# EAGLE board zx81 SD_12 (smd) build002 (EAGLE 9.6.2), part 1 of 2
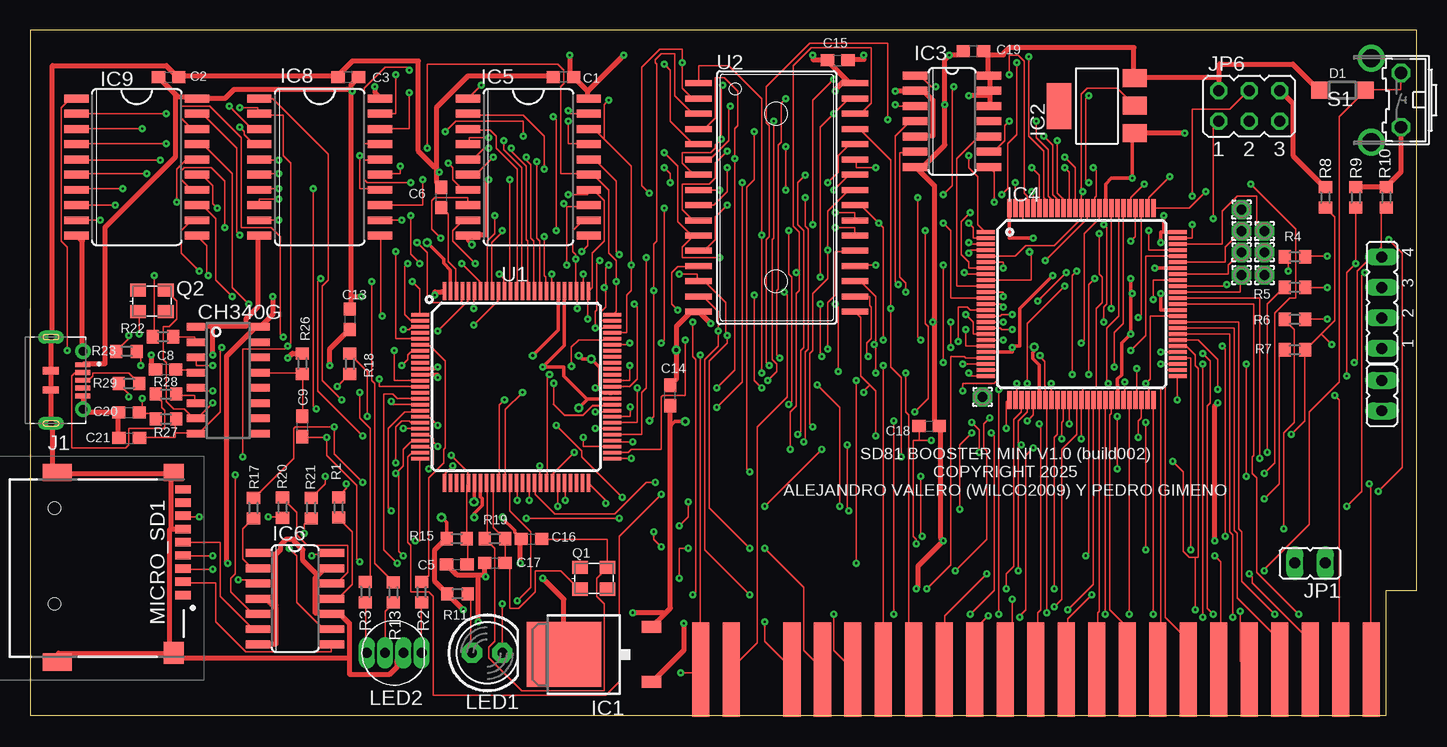
[diagram p3: board, top side]
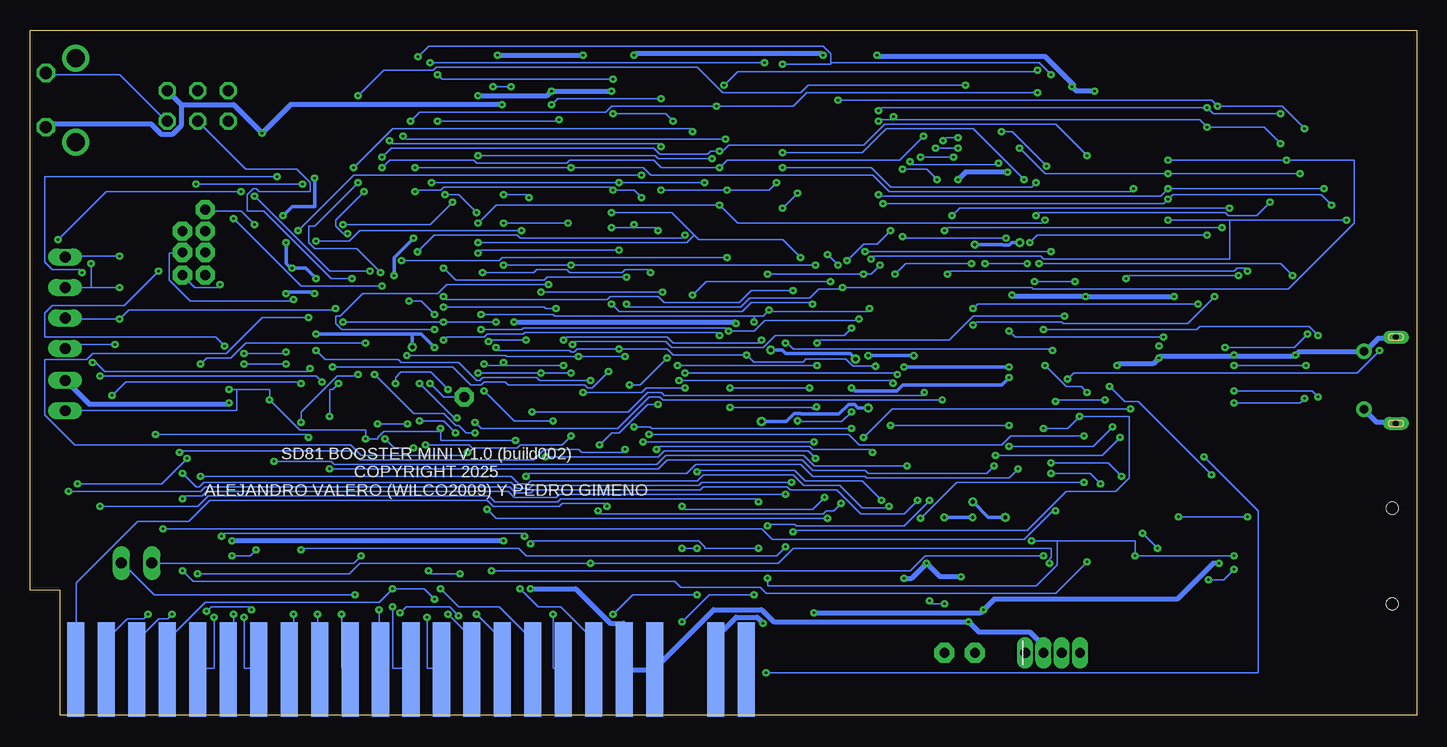
[diagram p4: board, bottom side, seen from below]

Size 115.57 x 57.15 mm. Coordinates in mm from the lower left corner, seen from the top.
Outline: 0,0 113.03,0 113.03,10.41 115.57,10.41 115.57,57.15 0,57.15 0,0
Copper layers (1*16): Top 0.035mm / dielectric 1.5mm / Bottom 0.035mm
Design rules "default *": minimum track width 5mil, minimum drill 0.2mm, track to track 6mil, track to pad 6mil, pad to pad 6mil, via to via 6mil, smd to smd 6mil, copper to edge 40mil, drill to drill 6mil, minimum pad ring 10mil, minimum via ring 8mil, stop-mask expansion 4mil, vias tented up to drill 999mil, thermal gap 10mil
Net classes: 1 VCC: width 0.3 mm; 2 3,3: width 0.3 mm

## Footprints (pad centres in the part's own frame; a part is rotated, then mirrored left to right if it is on the bottom)
EDGEPIN = smd 1.422 x 7.874: 1 0,0
C0603 = smd 1.1 x 1: 1 -0.85,0; 2 0.85,0
SOD123 = smd 1.4 x 1.4: A 1.9,0; C -1.9,0
TO252 = smd 1 x 1.6: 1 -2.28,-4.8; 2 2.28,-4.8 | smd 5.4 x 6.2: 3 0,2.5
SOT223 = smd 1.499 x 2.007: 1 -2.261,-3.15; 2 0.025,-3.15; 3 2.311,-3.15 | smd 3.81 x 2.007: 4 0,3.15
SO14 = smd 0.66 x 2.032: 1 -3.81,-3.073; 2 -2.54,-3.073; 3 -1.27,-3.073; 4 0,-3.073; 5 1.27,-3.073; 6 2.54,-3.073; 7 3.81,-3.073; 8 3.81,3.073; 9 2.54,3.073; 10 1.27,3.073; 11 0,3.073; 12 -1.27,3.073; 13 -2.54,3.073; 14 -3.81,3.073
TQFP100 = smd 1.5 x 0.345: 1 -8,6; 2 -8,5.5; 3 -8,5; 4 -8,4.5; 5 -8,4; 6 -8,3.5; 7 -8,3; 8 -8,2.5; 9 -8,2; 10 -8,1.5; 11 -8,1; 12 -8,0.5; 13 -8,0; 14 -8,-0.5; 15 -8,-1; 16 -8,-1.5; 17 -8,-2; 18 -8,-2.5; 19 -8,-3; 20 -8,-3.5; 21 -8,-4; 22 -8,-4.5; 23 -8,-5; 24 -8,-5.5; 25 -8,-6; 51 8,-6; 52 8,-5.5; 53 8,-5; 54 8,-4.5; 55 8,-4; 56 8,-3.5; 57 8,-3; 58 8,-2.5; 59 8,-2; 60 8,-1.5; 61 8,-1; 62 8,-0.5; 63 8,0; 64 8,0.5; 65 8,1; 66 8,1.5; 67 8,2; 68 8,2.5; 69 8,3; 70 8,3.5; 71 8,4; 72 8,4.5; 73 8,5; 74 8,5.5; 75 8,6 | smd 0.345 x 1.5: 26 -6,-8; 27 -5.5,-8; 28 -5,-8; 29 -4.5,-8; 30 -4,-8; 31 -3.5,-8; 32 -3,-8; 33 -2.5,-8; 34 -2,-8; 35 -1.5,-8; 36 -1,-8; 37 -0.5,-8; 38 0,-8; 39 0.5,-8; 40 1,-8; 41 1.5,-8; 42 2,-8; 43 2.5,-8; 44 3,-8; 45 3.5,-8; 46 4,-8; 47 4.5,-8; 48 5,-8; 49 5.5,-8; 50 6,-8; 76 6,8; 77 5.5,8; 78 5,8; 79 4.5,8; 80 4,8; 81 3.5,8; 82 3,8; 83 2.5,8; 84 2,8; 85 1.5,8; 86 1,8; 87 0.5,8; 88 0,8; 89 -0.5,8; 90 -1,8; 91 -1.5,8; 92 -2,8; 93 -2.5,8; 94 -3,8; 95 -3.5,8; 96 -4,8; 97 -4.5,8; 98 -5,8; 99 -5.5,8; 100 -6,8
SO20W = smd 0.66 x 2.032: 1 -5.715,-5.029; 2 -4.445,-5.029; 3 -3.175,-5.029; 4 -1.905,-5.029; 5 -0.635,-5.029; 6 0.635,-5.029; 7 1.905,-5.029; 8 3.175,-5.029; 9 4.445,-5.029; 10 5.715,-5.029; 11 5.715,5.029; 12 4.445,5.029; 13 3.175,5.029; 14 1.905,5.029; 15 0.635,5.029; 16 -0.635,5.029; 17 -1.905,5.029; 18 -3.175,5.029; 19 -4.445,5.029; 20 -5.715,5.029
SOIC16 = smd 0.635 x 1.524: 1 -4.445,-2.695; 2 -3.175,-2.695; 3 -1.905,-2.695; 4 -0.635,-2.695; 5 0.635,-2.695; 6 1.905,-2.695; 7 3.175,-2.695; 8 4.445,-2.695; 9 4.445,2.695; 10 3.175,2.695; 11 1.905,2.695; 12 0.635,2.695; 13 -0.635,2.695; 14 -1.905,2.695; 15 -3.175,2.695; 16 -4.445,2.695
SHOUHAN_MICROXNJ = smd 0.4 x 1.25: 1 1.3,-4.375; 2 0.65,-4.375; 3 0,-4.375; 4 -0.65,-4.375; 5 -1.3,-4.375 | smd 0.6 x 1.35: S1 -0.8,-1.725; S2 0.8,-1.725 | drill 0.5 pad 1.07 long: S3 -3.6,-1.75; S6 3.6,-1.75 | drill 0.7 pad 1.3: S4 -2.425,-4.4; S5 2.425,-4.4
JP1 = drill 0.914 long: 1 0,-1.27; 2 0,1.27
JP4 = drill 0.914 long: 1 -3.81,0; 2 -1.27,0; 3 1.27,0; 4 3.81,0
JP3Q = drill 0.914 octagon: 1 -2.54,-1.27; 2 -2.54,1.27; 3 0,-1.27; 4 0,1.27; 5 2.54,-1.27; 6 2.54,1.27
LED5MM = drill 0.813 pad 1.676 octagon: A -1.27,0; K 1.27,0
LED-RGB-THRU = drill 0.813 long: 1 2.286,0; 2 0.762,0; 3 -0.762,0; 4 -2.286,0
TF-01A = smd 0.7 x 1.3: 1 2.23,7.174; 2 1.13,7.174; 3 0.03,7.174; 4 -1.07,7.174; 5 -2.17,7.174; 6 -3.27,7.174; 7 -4.37,7.174; 8 -5.47,7.174; CD1 -6.57,7.174 | smd 1.448 x 1.651: MP1 -7.989,6.4 | smd 1.448 x 2.438: MP2 -7.989,-3.3; MP3 7.836,-3.3 | smd 1.854 x 1.651: MP4 7.061,6.4 | hole 1: -5.004,-3.531; 2.972,-3.531
1,6/0,8 = drill 0.813 pad 1.6 octagon: 1 0,0
3.2X2.5_KX-7 = smd 1.3 x 1.1: 1 -1.15,-0.9; 2 1.15,-0.9; 3 1.15,0.9; 4 -1.15,0.9
R0603 = smd 1 x 1.1: 1 -0.85,0; 2 0.85,0
B3F-31XX = drill 1.016 octagon: 1 -2.261,-1.245; 2 2.261,-1.245 | drill 1.499 pad 2.159: 3 -3.505,1.245; 4 3.505,1.245
TQFP100' = smd 1.5 x 0.3: 1 -8,6; 2 -8,5.5; 3 -8,5; 4 -8,4.5; 5 -8,4; 6 -8,3.5; 7 -8,3; 8 -8,2.5; 9 -8,2; 10 -8,1.5; 11 -8,1; 12 -8,0.5; 13 -8,0; 14 -8,-0.5; 15 -8,-1; 16 -8,-1.5; 17 -8,-2; 18 -8,-2.5; 19 -8,-3; 20 -8,-3.5; 21 -8,-4; 22 -8,-4.5; 23 -8,-5; 24 -8,-5.5; 25 -8,-6; 51 8,-6; 52 8,-5.5; 53 8,-5; 54 8,-4.5; 55 8,-4; 56 8,-3.5; 57 8,-3; 58 8,-2.5; 59 8,-2; 60 8,-1.5; 61 8,-1; 62 8,-0.5; 63 8,0; 64 8,0.5; 65 8,1; 66 8,1.5; 67 8,2; 68 8,2.5; 69 8,3; 70 8,3.5; 71 8,4; 72 8,4.5; 73 8,5; 74 8,5.5; 75 8,6 | smd 0.3 x 1.5: 26 -6,-8; 27 -5.5,-8; 28 -5,-8; 29 -4.5,-8; 30 -4,-8; 31 -3.5,-8; 32 -3,-8; 33 -2.5,-8; 34 -2,-8; 35 -1.5,-8; 36 -1,-8; 37 -0.5,-8; 38 0,-8; 39 0.5,-8; 40 1,-8; 41 1.5,-8; 42 2,-8; 43 2.5,-8; 44 3,-8; 45 3.5,-8; 46 4,-8; 47 4.5,-8; 48 5,-8; 49 5.5,-8; 50 6,-8; 76 6,8; 77 5.5,8; 78 5,8; 79 4.5,8; 80 4,8; 81 3.5,8; 82 3,8; 83 2.5,8; 84 2,8; 85 1.5,8; 86 1,8; 87 0.5,8; 88 0,8; 89 -0.5,8; 90 -1,8; 91 -1.5,8; 92 -2,8; 93 -2.5,8; 94 -3,8; 95 -3.5,8; 96 -4,8; 97 -4.5,8; 98 -5,8; 99 -5.5,8; 100 -6,8
SOP32-5 = smd 2.2 x 0.5: 1 -6.516,9.525; 2 -6.516,8.255; 3 -6.516,6.985; 4 -6.516,5.715; 5 -6.516,4.445; 6 -6.516,3.175; 7 -6.516,1.905; 8 -6.516,0.635; 9 -6.516,-0.635; 10 -6.516,-1.905; 11 -6.516,-3.175; 12 -6.516,-4.445; 13 -6.516,-5.715; 14 -6.516,-6.985; 15 -6.516,-8.255; 16 -6.516,-9.525; 17 6.516,-9.525; 18 6.516,-8.255; 19 6.516,-6.985; 20 6.516,-5.715; 21 6.516,-4.445; 22 6.516,-3.175; 23 6.516,-1.905; 24 6.516,-0.635; 25 6.516,0.635; 26 6.516,1.905; 27 6.516,3.175; 28 6.516,4.445; 29 6.516,5.715; 30 6.516,6.985; 31 6.516,8.255; 32 6.516,9.525

## Placement (x,y rotation side)
1A  D7  [EDGEPIN]  55.88,3.81 0 top
1B  VCC  [EDGEPIN]  55.88,3.81 180 bottom
2A  /RAMCS  [EDGEPIN]  58.42,3.81 0 top
2B  9V  [EDGEPIN]  58.42,3.81 180 bottom
4A  D0  [EDGEPIN]  63.5,3.81 0 top
4B  GND  [EDGEPIN]  63.5,3.81 180 bottom
5A  D1  [EDGEPIN]  66.04,3.81 0 top
5B  GND  [EDGEPIN]  66.04,3.81 180 bottom
6A  D2  [EDGEPIN]  68.58,3.81 0 top
6B  /CLOCK  [EDGEPIN]  68.58,3.81 180 bottom
7A  D6  [EDGEPIN]  71.12,3.81 0 top
7B  A0  [EDGEPIN]  71.12,3.81 180 bottom
8A  D5  [EDGEPIN]  73.66,3.81 0 top
8B  A1  [EDGEPIN]  73.66,3.81 180 bottom
9A  D3  [EDGEPIN]  76.2,3.81 0 top
9B  A2  [EDGEPIN]  76.2,3.81 180 bottom
10A  D4  [EDGEPIN]  78.74,3.81 0 top
10B  A3  [EDGEPIN]  78.74,3.81 180 bottom
11A  A6  [EDGEPIN]  81.28,3.81 0 top
11B  A15  [EDGEPIN]  81.28,3.81 180 bottom
12A  /NMI  [EDGEPIN]  83.82,3.81 0 top
12B  A14  [EDGEPIN]  83.82,3.81 180 bottom
13A  /HALT  [EDGEPIN]  86.36,3.81 0 top
13B  A13  [EDGEPIN]  86.36,3.81 180 bottom
14A  /MREQ  [EDGEPIN]  88.9,3.81 0 top
14B  A12  [EDGEPIN]  88.9,3.81 180 bottom
15A  /IORQ  [EDGEPIN]  91.44,3.81 0 top
15B  A11  [EDGEPIN]  91.44,3.81 180 bottom
16A  /RD  [EDGEPIN]  93.98,3.81 0 top
16B  A10  [EDGEPIN]  93.98,3.81 180 bottom
17A  /WR  [EDGEPIN]  96.52,3.81 0 top
17B  A9  [EDGEPIN]  96.52,3.81 180 bottom
18A  /BUSAK  [EDGEPIN]  99.06,3.81 0 top
18B  A8  [EDGEPIN]  99.06,3.81 180 bottom
19A  /WAIT  [EDGEPIN]  101.6,3.81 0 top
19B  A7  [EDGEPIN]  101.6,3.81 180 bottom
20A  /BUSRQ  [EDGEPIN]  104.14,3.81 0 top
20B  A6  [EDGEPIN]  104.14,3.81 180 bottom
21A  /RESET  [EDGEPIN]  106.68,3.81 0 top
21B  A5  [EDGEPIN]  106.68,3.81 180 bottom
22A  /M1  [EDGEPIN]  109.22,3.81 0 top
22B  A4  [EDGEPIN]  109.22,3.81 180 bottom
23A  /RFSH  [EDGEPIN]  111.76,3.81 0 top
23B  /ROMCS  [EDGEPIN]  111.76,3.81 180 bottom
C1  100nF  [C0603]  44.45,53.21 180 top
C2  100nF  [C0603]  11.56,53.21 0 top
C3  100nF  [C0603]  26.52,53.21 180 top
C5  22pF  [C0603]  35.56,12.57 0 top
C6  0.1uF  [C0603]  34.29,43.18 90 top
C8  0.1uF  [C0603]  11.3,28.86 0 top
C9  100nF  [C0603]  22.71,24.08 90 top
C13  0.1uF  [C0603]  26.65,33.03 270 top
C14  0.1uF  [C0603]  53.34,26.67 90 top
C15  100nF  [C0603]  67.31,54.61 0 top
C16  22pF  [C0603]  41.8,14.71 0 top
C17  22pF  [C0603]  38.73,12.7 0 top
C18  100nF  [C0603]  74.93,24.13 0 top
C19  100nF  [C0603]  78.61,55.37 180 top
C20  22pF  [C0603]  8.24,25.26 0 top
C21  22pF  [C0603]  8.27,23.11 0 top
D1  [SOD123]  109.36,52.13 0 top
IC1  7805DT  [TO252]  46.99,5.08 90 top
IC2  REG1117  [SOT223]  88.9,50.8 90 top
IC3  74ACT125D  [SO14]  76.83,49.53 270 top
IC4  XC95144XL-10TQG100C  [TQFP100]  87.63,34.29 0 top
IC5  74HC573D  [SO20W]  41.53,45.72 270 top
IC6  74LVC125  [SO14]  22.09,9.73 270 top
IC7  CH340G  [SOIC16]  16.51,27.94 270 top
IC8  74HC573D  [SO20W]  24.13,45.72 270 top
IC9  74HC573D  [SO20W]  8.89,45.72 270 top
J1  MICROXNJ (C404969)  [SHOUHAN_MICROXNJ]  0,27.94 90 top
JP1  MC45  [JP1]  106.68,12.7 90 top
JP2  [JP1]  112.65,26.67 0 top
JP3  JTAG  [JP4]  112.65,34.42 90 top
JP6  ICSP  [JP3Q]  101.6,50.8 0 top
LED1  SD  [LED5MM]  38.1,5.21 0 top
LED2  DIFFUSE  [LED-RGB-THRU]  30.35,5.21 0 top
MICRO_SD1  TF-01A  [TF-01A]  5.58,12.27 270 top
PAD1  [1,6/0,8]  79.38,26.54 0 top
PAD2  [1,6/0,8]  100.97,36.7 0 top
PAD3  [1,6/0,8]  102.87,36.7 0 top
PAD4  [1,6/0,8]  102.87,38.61 0 top
PAD5  [1,6/0,8]  100.97,38.61 0 top
PAD6  [1,6/0,8]  102.87,40.39 0 top
PAD7  [1,6/0,8]  100.97,40.39 0 top
PAD8  [1,6/0,8]  100.97,42.16 0 top
Q1  16MHz  [3.2X2.5_KX-7]  46.99,11.43 0 top
Q2  12MHz  [3.2X2.5_KX-7]  10.16,34.56 0 top
R1  0R  [R0603]  25.72,17.34 270 top
R2  150  [R0603]  32.64,10.28 270 top
R3  68  [R0603]  27.94,10.29 270 top
R4  180  [R0603]  105.41,38.23 0 top
R5  180  [R0603]  105.41,35.69 0 top
R6  100  [R0603]  105.41,33.02 0 top
R7  180  [R0603]  105.41,30.48 0 top
R8  330  [R0603]  107.95,43.18 270 top
R9  330  [R0603]  110.49,43.18 270 top
R10  330  [R0603]  113.03,43.18 270 top
R11  680  [R0603]  35.62,10.14 0 top
R13  150  [R0603]  30.28,10.26 270 top
R15  [R0603]  35.56,14.73 180 top
R17  3k3  [R0603]  18.62,17.28 270 top
R18  3k3  [R0603]  26.65,29.32 270 top
R19  1M  [R0603]  38.73,14.73 180 top
R20  3k3  [R0603]  21.05,17.32 270 top
R21  3k3  [R0603]  23.43,17.29 270 top
R22  1K  [R0603]  11.08,31.57 0 top
R23  1K  [R0603]  8.05,30.34 0 top
R26  1K  [R0603]  22.7,29.33 90 top
R27  1M  [R0603]  11.33,24.71 180 top
R28  22R  [R0603]  11.33,26.79 180 top
R29  22R  [R0603]  8.26,27.67 0 top
S1  [B3F-31XX]  113,51.31 90 top
U1  ATMEGA2560AU  [TQFP100']  40.54,27.4 0 top
U2  AS6C4008-55SINSOP5  [SOP32-5]  62.23,43.18 0 top

## Tracks (layer width: path | path; a pad name or v marks a point on that pad's centre or on a via)
3V3  (via drill 0.2)
  Top 0.127: v15.23,13.3 12.86,13.3 MICRO_SD1.4 | v23.48,13.3 23.61,13.43 25.11,13.43 IC6.14 | v32.1,14.55 32.48,14.55 32.48,21.3 U1.25 | 87.48,41.3 87.61,41.42 87.61,42.17 IC4.88 87.61,42.3 87.61,43.67 | 87.48,41.3 85.36,39.17 82.98,39.17 82.11,38.3 79.73,38.3 IC4.5 | 87.48,41.3 82.73,41.3 82.73,42.17 IC4.98 | 87.61,43.67 87.61,51.8 88.11,52.3 90.61,52.3 91.98,50.92 IC2.2 | 74.11,22.93 74.11,24.05 C18.1 | v75.11,22.93 74.11,22.93 | v81.36,23.93 81.36,26.18 81.61,26.18 IC4.26 | v87.61,23.05 87.61,26.18 IC4.38 87.73,26.3 87.73,27.18 87.86,27.3 88.86,27.3 88.86,33.92 89.36,34.42 89.36,36.55 89.11,36.8 v89.11,40.17 | v95.61,26.3 95.61,28.18 IC4.51 | v98.98,27.18 98.98,29.68 97.36,31.3 95.73,31.3 IC4.57 | v87.73,43.67 87.61,43.67 | v54.1,11.43 54.1,13.93 v54.85,13.93 | v73.86,14.3 73.86,14.68 73.61,14.93 73.61,22.93 74.11,22.93
  Bottom 0.127: v15.23,13.3 v23.48,13.3 23.48,14.55 29.98,14.55 | 29.98,14.55 v32.1,14.55 | v75.11,22.93 81.36,22.93 81.36,23.68 | 81.36,23.68 86.11,23.68 86.61,23.18 86.61,23.05 v87.61,23.05 87.61,23.8 93.11,23.8 v95.61,26.3 95.61,27.18 98.36,27.18 | 81.36,23.68 v81.36,23.93 | 98.36,27.18 v98.98,27.18 | 98.36,27.18 98.36,25.43 112.61,25.43 JP2.1 | v87.73,43.67 90.11,41.3 90.11,40.8 89.48,40.17 v89.11,40.17 | 29.98,14.55 29.98,12.55 31.73,10.8 54.1,10.8 v54.1,11.43 | v54.85,13.93 59.35,13.93 59.35,14.05 59.85,14.55 73.86,14.55 v73.86,14.3
9V  (via drill 0.2)
  Top 0.4: v54.48,7.67 54.48,5.42 51.85,2.8 IC1.1
  Bottom 0.4: v54.48,7.67 54.98,8.18 56.73,8.18 58.35,6.55 58.35,3.92 2B.1
74573_OC  (via drill 0.2)
  Top 0.127: v30.11,26.18 30.11,25.93 32.48,25.93 U1.16 | v25.98,26.3 24.36,27.93 24.36,35.8 24.86,36.3 24.86,46.8 20.23,51.42 19.11,51.42 IC8.1
  Bottom 0.127: v30.11,26.18 29.98,26.3 v25.98,26.3
/BUSAK  (via drill 0.2)
  Top 0.127: v96.73,13.8 96.73,29.8 95.73,29.8 IC4.54 | v98.73,13.3 99.23,12.8 99.23,4.05 99.11,3.92 18A.1
  Bottom 0.127: v96.73,13.8 97.23,13.3 v98.73,13.3
/BUSRQ
  Top 0.127: IC4.59 95.73,32.3 100.36,32.3 100.36,15.43 100.61,15.18 100.61,9.8 104.11,6.3 104.11,3.92 20A.1
/CLOCK  (via drill 0.2)
  Top 0.127: v74.73,10.55 76.73,12.55 76.73,29.93 77.86,29.93 77.98,29.8 79.61,29.8 IC4.22
  Bottom 0.127: v74.73,10.55 73.23,9.05 71.36,9.05 68.61,6.3 68.61,3.92 6B.1
/HALT  (via drill 0.2)
  Top 0.127: v88.48,10.05 86.48,8.05 86.48,3.92 13A.1
  Bottom 0.127: v88.48,10.05 105.23,10.05 107.86,12.68 JP1.1
/IORQ
  Top 0.127: IC4.43 90.11,26.18 90.11,25.18 89.98,25.05 89.98,8.8 91.36,7.42 91.36,3.92 15A.1
/M1  (via drill 0.2)
  Top 0.127: v92.98,27.68 93.36,28.05 93.36,33.3 95.61,33.3 IC4.61 | v108.73,26.68 109.11,26.3 109.11,3.92 22A.1
  Bottom 0.127: v92.98,27.68 93.11,27.8 107.61,27.8 v108.73,26.68
/MEM_CE  (via drill 0.2)
  Top 0.127: v47.98,17.68 47.98,17.93 46.6,19.3 U1.50 | v68.23,17.05 68.11,17.18 v68.11,22.55 | v63.23,25.93 63.48,26.18 63.48,36.55 63.23,36.8 v63.23,40.42 | v67.11,40.67 68.73,40.67 68.73,40.05 U2.22 | v81.61,53.42 81.61,55.05 82.36,55.05 82.86,54.55 82.86,43.55 83.11,43.3 83.11,42.3 IC4.97 | v66.98,53.05 65.23,51.3 v65.23,40.92
  Bottom 0.127: v47.98,17.68 48.6,17.05 49.23,17.05 49.48,16.8 67.98,16.8 v68.23,17.05 | v68.11,22.55 67.11,23.55 66.48,23.55 64.11,25.93 v63.23,25.93 | v63.23,40.42 63.48,40.67 65.23,40.67 | v67.11,40.67 65.23,40.67 | v81.61,53.42 81.23,53.05 v66.98,53.05 | 65.23,40.67 v65.23,40.92
/MEM_OE  (via drill 0.2)
  Top 0.127: v54.6,31.3 54.6,26.68 52.73,26.68 52.6,26.55 52.6,22.18 50.1,22.18 49.85,21.93 48.6,21.93 U1.52 | v71.11,31.3 71.11,40.67 v70.73,41.05 69.36,42.42 68.86,42.42 U2.24 | v76.11,41.05 76.73,40.42 76.73,34.8 79.61,34.8 IC4.12
  Bottom 0.127: v54.6,31.3 54.85,31.05 61.98,31.05 62.48,31.55 70.86,31.55 v71.11,31.3 | v70.73,41.05 v76.11,41.05
/MREQ
  Top 0.127: IC4.41 89.11,26.18 89.11,8.68 88.98,8.55 88.98,3.92 14A.1
/NMI  (via drill 0.2)
  Top 0.127: v86.61,24.3 86.61,26.18 IC4.36 | v84.11,24.3 84.23,24.18 84.23,8.8 83.98,8.55 83.98,4.05 83.86,3.92 12A.1
  Bottom 0.127: v84.11,24.3 v86.61,24.3
/OE_CTRL_CLOCK
  Top 0.127: IC4.10 79.61,35.8 77.23,35.8 77.23,46.42 78.98,48.17 79.86,48.17 IC3.10
/OE_IL  (via drill 0.2)
  Top 0.127: v81.86,33.42 80.98,33.42 80.86,33.3 79.73,33.3 IC4.15 | v86.36,36.92 v83.98,34.55 | v88.23,44.42 87.98,44.67 87.98,51.42 v88.23,51.67 | v37.6,52.55 36.6,51.55 IC5.1
  Bottom 0.127: v81.86,33.42 82.98,34.55 v83.98,34.55 | v86.36,36.92 88.36,38.92 91.86,38.92 92.36,39.42 92.36,40.8 91.86,40.8 v88.23,44.42 | v88.23,51.67 86.11,53.8 81.98,53.8 81.73,54.05 59.98,54.05 57.85,51.92 51.35,51.92 50.73,52.55 v37.6,52.55
/OE_RAMCS  (via drill 0.2)
  Top 0.127: v81.86,32.17 80.98,32.17 80.86,32.3 79.73,32.3 IC4.17 | v72.36,35.92 72.11,36.17 72.11,48.3 73.23,49.42 73.73,49.42 IC3.4
  Bottom 0.127: v81.86,32.17 89.61,32.17 90.11,32.67 90.11,33.3 89.73,33.3 87.86,35.17 81.61,35.17 80.86,35.92 v72.36,35.92
/OE_ROMCS  (via drill 0.2)
  Top 0.127: v77.36,31.18 77.36,34.05 78.11,34.05 78.36,33.8 79.61,33.8 IC4.14 | v74.23,31.3 73.98,31.55 v73.98,43.17 | v76.11,43.42 76.86,44.17 76.86,52.3 v76.98,52.42 | v75.48,52.42 75.11,52.42 74.23,53.3 73.86,53.3 IC3.1
  Bottom 0.127: v77.36,31.18 77.23,31.3 v74.23,31.3 | v73.98,43.17 74.23,43.42 v76.11,43.42 | v75.48,52.42 v76.98,52.42
/RAMCS  (via drill 0.2)
  Top 0.127: v72.98,35.3 72.98,36.05 72.48,36.55 72.48,46.92 73.73,46.92 IC3.6 | v62.85,35.3 63.1,35.05 63.1,26.55 60.6,24.05 60.6,6.05 58.48,3.92 2A.1
  Bottom 0.127: v62.85,35.3 v72.98,35.3
/RD
  Top 0.127: IC4.49 93.23,26.3 93.23,27.18 93.36,27.3 94.23,27.3 94.23,4.17 93.98,3.92 16A.1
/RESET  (via drill 0.2)
  Top 0.127: v30.61,12.68 29.48,13.8 29.48,26.8 30.23,26.8 30.61,26.43 32.48,26.43 U1.15 | v101.61,11.8 101.86,11.55 101.86,11.05 106.61,6.3 106.61,3.92 21A.1 | v91.73,30.43 92.98,31.68 92.98,38.3 95.61,38.3 IC4.71 | v68.86,12.68 v68.86,27.93
  Bottom 0.127: v30.61,12.68 30.61,13.05 30.48,13.18 30.48,13.93 51.98,13.93 53.23,12.68 v68.86,12.68 88.11,12.68 88.98,11.8 v101.61,11.8 | v91.73,30.43 90.98,29.68 84.87,29.68 84.62,29.43 79.86,29.43 78.36,27.93 78.11,27.93 77.86,28.18 73.36,28.18 73.11,27.93 v68.86,27.93
/RFSH  (via drill 0.2)
  Top 0.127: v102.48,21.43 102.48,34.8 95.73,34.8 IC4.64 | v111.61,19.3 111.73,19.18 111.73,3.92 23A.1
  Bottom 0.127: v102.48,21.43 104.61,19.3 v111.61,19.3
/ROMCS  (via drill 0.2)
  Top 0.127: IC3.3 72.11,50.8 v72.11,50.92 | v62.98,51.42 62.6,51.05 62.6,47.8 62.35,47.55 62.35,35.55 62.23,35.42 62.23,30.05 v62.48,29.8 | v65.61,27.55 67.48,25.68 v67.48,17.43
  Bottom 0.127: v72.11,50.92 71.61,51.42 v62.98,51.42 | v62.48,29.8 64.73,27.55 v65.61,27.55 | v67.48,17.43 67.73,17.68 71.23,17.68 71.48,17.43 76.98,17.43 77.48,17.93 100.61,17.93 102.36,16.18 106.61,16.18 111.73,11.05 111.73,3.92 23B.1
/WAIT  (via drill 0.2)
  Top 0.127: v42.48,20.8 42.48,19.43 U1.42 | v95.23,21.18 96.11,20.3 96.11,13.68 96.61,13.18 97.11,13.18 | 97.11,13.18 97.36,13.18 97.36,28.93 97.11,29.18 97.11,30.05 96.36,30.8 95.73,30.8 IC4.56 | v100.86,8.68 100.86,4.55 101.48,3.92 19A.1 | 97.11,13.18 v97.11,8.8
  Bottom 0.127: v42.48,20.8 50.23,20.8 51.1,21.68 62.6,21.68 63.35,20.93 90.23,20.93 90.48,21.18 v95.23,21.18 | v100.86,8.68 100.48,9.05 97.36,9.05 v97.11,8.8
/WR
  Top 0.127: IC4.52 95.61,28.8 94.61,28.8 94.61,8.18 96.48,6.3 96.48,3.92 17A.1
/WR'  (via drill 0.2)
  Top 0.127: v50.1,21.43 48.6,21.43 U1.51 | v72.61,21.55 72.61,28.18 71.73,29.05 v71.73,33.92 71.73,46.3 69.23,48.8 68.86,48.8 U2.29 | v81.11,34.05 81.11,34.3 79.73,34.3 IC4.13
  Bottom 0.127: v50.1,21.43 50.73,22.05 62.73,22.05 63.23,21.55 v72.61,21.55 | v81.11,34.05 72.73,34.05 72.61,33.92 v71.73,33.92
A0  (via drill 0.2)
  Top 0.127: v77.73,27.05 77.73,27.68 80.36,27.68 80.61,27.93 80.61,28.8 79.73,28.8 IC4.24 | v71.98,8.43 v71.98,24.55
  Bottom 0.127: v77.73,27.05 75.23,24.55 v71.98,24.55 | v71.98,8.43 71.98,3.92 71.23,3.92 7B.1
A0'  (via drill 0.2)
  Top 0.127: v78.23,41.05 78.61,40.67 78.61,39.8 79.61,39.8 IC4.2 | v58.1,42.55 57.1,41.55 57.1,39.67 56.23,38.8 55.73,38.8 U2.12 | v30.98,41.3 29.23,41.3 IC8.12
  Bottom 0.127: v78.23,41.05 76.73,42.55 v58.1,42.55 56.6,41.05 31.23,41.05 v30.98,41.3
A1  (via drill 0.2)
  Top 0.127: v81.36,10.55 81.36,11.8 81.98,12.43 81.98,24.68 82.61,25.3 82.61,26.18 IC4.28
  Bottom 0.127: v81.36,10.55 79.86,9.05 76.48,9.05 73.73,6.3 73.73,3.92 8B.1
A1'  (via drill 0.2)
  Top 0.127: v84.61,37.92 88.11,41.42 88.11,42.17 IC4.87 | v57.48,38.17 54.35,38.17 54.35,39.05 55.23,39.92 | 55.23,39.92 55.6,39.92 U2.11 55.23,39.92 | v32.73,44.67 32.73,42.55 29.23,42.55 IC8.13 | v52.85,46.92 53.98,45.8 53.98,41.17 55.23,39.92
  Bottom 0.127: v84.61,37.92 76.48,37.92 76.23,38.17 v57.48,38.17 | v32.73,44.67 36.98,48.92 44.23,48.92 46.23,46.92 v52.85,46.92
A2  (via drill 0.2)
  Top 0.127: v83.11,24.55 83.61,25.05 83.61,26.18 IC4.30 | v80.11,23.55 80.36,23.3 80.36,10.43 v78.36,8.43
  Bottom 0.127: v83.11,24.55 81.11,24.55 v80.11,23.55 | v78.36,8.43 76.23,6.3 76.23,3.92 9B.1
A2'  (via drill 0.2)
  Top 0.127: v86.23,46.55 87.11,45.67 87.11,42.3 IC4.89 | v58.1,47.05 57.1,46.05 57.1,44.8 56.6,44.3 54.35,44.3 54.35,42.17 55.23,41.3 55.6,41.3 U2.10 | v27.48,46.67 27.48,43.92 29.11,43.92 IC8.14
  Bottom 0.127: v86.23,46.55 85.48,47.3 63.6,47.3 63.1,46.8 59.1,46.8 58.85,47.05 v58.1,47.05 57.85,47.05 57.35,47.55 46.1,47.55 44.35,49.3 30.11,49.3 v27.48,46.67
A3  (via drill 0.2)
  Top 0.127: v85.11,27.68 85.11,26.3 IC4.33 | v80.73,8.43 v80.73,27.18
  Bottom 0.127: v85.11,27.68 85.11,28.17 84.66,28.62 82.18,28.62 v80.73,27.18 | v80.73,8.43 78.86,6.55 78.86,3.92 10B.1
A3'  (via drill 0.2)
  Top 0.127: v86.23,45.67 86.61,45.3 86.61,42.3 IC4.90 | v58.1,45.67 58.1,43.67 56.98,42.55 55.73,42.55 U2.9 | v30.86,45.8 30.86,45.17 29.23,45.17 IC8.15 | v34.6,48.67 35.48,49.55 41.1,49.55 v41.1,48.3
  Bottom 0.127: v86.23,45.67 85.61,46.3 78.61,46.3 78.36,46.05 70.86,46.05 70.61,46.3 63.6,46.3 62.98,45.67 v58.1,45.67 57.48,46.3 43.1,46.3 v41.1,48.3 | v30.86,45.8 33.73,48.67 v34.6,48.67
A4  (via drill 0.2)
  Top 0.127: v105.73,8.43 102.23,11.93 102.23,19.8 101.86,20.18 101.86,21.55 101.98,21.68 101.98,34.3 95.73,34.3 IC4.63
  Bottom 0.127: v105.73,8.43 106.11,8.05 107.48,8.05 109.11,6.42 109.11,3.92 22B.1
A4'  (via drill 0.2)
  Top 0.127: v85.61,47.92 85.61,43.55 86.11,43.05 86.11,42.3 IC4.91 | v62.98,43.8 v62.98,47.42 | v57.48,43.8 55.73,43.8 U2.8 | v31.73,44.42 28.11,44.42 27.86,44.67 27.86,46.3 29.11,46.3 IC8.16 | v52.85,45.67 53.35,45.17 v53.35,44.42
  Bottom 0.127: v85.61,47.92 85.36,47.67 63.23,47.67 v62.98,47.42 | v62.98,43.8 v57.48,43.8 53.98,43.8 v53.35,44.42 | v31.73,44.42 32.1,44.05 43.85,44.05 45.48,45.67 v52.85,45.67
A5  (via drill 0.2)
  Top 0.127: v103.73,8.43 100.98,11.18 100.98,15.3 100.73,15.55 100.73,32.8 95.73,32.8 IC4.60
  Bottom 0.127: v103.73,8.43 104.11,8.05 104.86,8.05 106.61,6.3 106.61,3.92 21B.1
A5'  (via drill 0.2)
  Top 0.127: v84.48,48.3 85.23,47.55 85.23,43.42 85.61,43.05 85.61,42.3 IC4.92 | U2.7 55.6,45.17 55.23,45.17 54.35,46.05 54.35,46.92 56.73,46.92 57.1,47.3 57.1,47.55 v57.6,48.05 57.6,52.42 v57.73,52.55 | v31.61,53.8 31.61,54.05 29.61,54.05 27.86,52.3 27.86,47.67 29.11,47.67 IC8.17
  Bottom 0.127: v84.48,48.3 84.23,48.05 v57.6,48.05 | v31.61,53.8 31.73,53.67 56.6,53.67 v57.73,52.55
A6  (via drill 0.2)
  Top 0.127: v85.36,10.55 85.36,23.18 85.61,23.43 85.61,26.18 IC4.34 | v81.86,9.68 81.86,4.42 81.36,3.92 11A.1
  Bottom 0.127: 20B.1 104.11,3.92 104.11,6.3 100.98,9.43 86.48,9.43 v85.36,10.55 82.73,10.55 v81.86,9.68
A6'  (via drill 0.2)
  Top 0.127: v83.86,49.55 83.86,48.17 84.86,47.17 84.86,43.3 85.11,43.05 85.11,42.3 IC4.93 | v58.35,50.8 58.23,50.67 58.23,47.92 56.73,46.42 55.73,46.42 U2.6 | v31.61,51.92 31.61,48.92 29.23,48.92 IC8.18
  Bottom 0.127: v83.86,49.55 83.11,50.3 67.61,50.3 67.11,50.8 v58.35,50.8 51.98,50.8 50.85,51.92 v31.61,51.92
A7  (via drill 0.2)
  Top 0.127: v100.23,8.18 100.23,15.05 99.98,15.3 99.98,31.8 95.73,31.8 IC4.58
  Bottom 0.127: v100.23,8.18 100.23,3.92 101.48,3.92 19B.1
A7'  (via drill 0.2)
  Top 0.127: v83.23,54.92 83.23,48.3 84.48,47.05 84.48,43.17 84.61,43.05 84.61,42.3 IC4.94 | v52.85,54.3 53.35,53.8 53.35,49.55 55.23,47.67 55.6,47.67 U2.5 | v30.48,53.42 30.48,50.17 29.23,50.17 IC8.19
  Bottom 0.127: v83.23,54.92 82.36,55.8 49.48,55.8 48.85,55.17 48.85,54.42 | 48.85,54.42 48.85,54.3 v52.85,54.3 | v30.48,53.42 31.48,54.42 48.85,54.42
A8  (via drill 0.2)
  Top 0.127: v94.23,30.3 95.61,30.3 IC4.55 | v97.73,30.18 98.36,29.55 98.36,26.05 98.11,25.8 98.11,8.93 v98.61,8.43
  Bottom 0.127: v94.23,30.3 94.36,30.18 v97.73,30.18 | v98.61,8.43 98.61,3.92 98.98,3.92 18B.1
A8'  (via drill 0.2)
  Top 0.127: v46.1,23.18 46.1,22.43 48.48,22.43 U1.53 | v23.86,25.55 23.61,25.8 v23.61,43.92 | v70.48,45.67 68.86,45.67 68.86,46.3 U2.27 | v83.48,45.67 84.11,45.05 84.11,42.3 IC4.95
  Bottom 0.127: v46.1,23.18 43.73,25.55 v23.86,25.55 | v23.61,43.92 23.86,43.67 43.98,43.67 45.35,45.05 63.85,45.05 64.48,45.67 v70.48,45.67 v83.48,45.67
A9  (via drill 0.2)
  Top 0.127: v94.23,29.3 95.61,29.3 IC4.53 | v97.73,8.18 v97.73,29.3
  Bottom 0.127: v97.73,29.3 v94.23,29.3 | v97.73,8.18 97.73,3.92 96.61,3.92 17B.1
A9'  (via drill 0.2)
  Top 0.127: v50.23,22.8 48.6,22.8 U1.54 | v64.48,22.8 64.61,22.93 64.61,30.3 64.86,30.55 64.86,40.55 64.61,40.8 v64.61,43.17 | v66.98,43.8 68.23,45.05 68.73,45.05 U2.26 | v83.48,43.67 83.61,43.55 83.61,42.3 IC4.96
  Bottom 0.127: v64.48,22.8 v50.23,22.8 | v64.61,43.17 65.23,43.8 v66.98,43.8 67.23,44.05 81.11,44.05 81.36,43.8 83.36,43.8 v83.48,43.67
A10  (via drill 0.2)
  Top 0.127: v93.61,8.43 93.61,26.18 IC4.50
  Bottom 0.127: v93.61,8.43 93.61,3.92 93.98,3.92 16B.1
A10'  (via drill 0.2)
  Top 0.127: v51.35,38.17 51.35,27.3 50.98,26.93 50.98,23.43 48.6,23.43 U1.55 | v67.11,41.92 68.73,41.92 68.73,41.3 U2.23 | v78.23,39.42 78.23,39.3 79.61,39.3 IC4.3
  Bottom 0.127: v51.35,38.17 52.85,39.67 59.85,39.67 60.23,40.05 | 60.23,40.05 62.1,41.92 v67.11,41.92 | v78.23,39.42 60.85,39.42 60.23,40.05
A11  (via drill 0.2)
  Top 0.127: v91.61,8.43 91.61,26.18 IC4.46
  Bottom 0.127: v91.61,8.43 91.61,3.92 91.48,3.92 15B.1
A11'  (via drill 0.2)
  Top 0.127: v47.1,23.93 48.48,23.93 U1.56 | v65.23,24.05 64.98,24.3 64.98,30.18 65.23,30.43 65.23,35.17 66.48,36.42 v66.48,38.8 66.48,42.05 68.23,43.8 68.73,43.8 U2.25 | v78.23,38.55 78.23,38.8 79.61,38.8 IC4.4
  Bottom 0.127: v65.23,24.05 63.87,24.05 63.74,23.92 v47.11,23.92 v47.1,23.93 | v78.23,38.55 77.98,38.8 v66.48,38.8
A12  (via drill 0.2)
  Top 0.127: v89.61,8.43 89.61,26.18 IC4.42
  Bottom 0.127: v89.61,8.43 89.61,3.92 88.98,3.92 14B.1
A12'  (via drill 0.2)
  Top 0.127: v50.6,27.3 50.6,24.43 48.6,24.43 U1.57 | v57.23,27.3 58.73,28.8 v58.73,46.42 58.73,48.92 58.98,49.17 58.98,52.05 57.85,53.17 57.1,53.17 57.1,49.8 56.23,48.92 55.73,48.92 U2.4 | v78.23,46.67 78.23,45.67 78.98,44.92 78.98,40.92 79.61,40.3 IC4.1
  Bottom 0.127: v57.23,27.3 v50.6,27.3 | v78.23,46.67 63.48,46.67 63.23,46.42 v58.73,46.42
A13  (via drill 0.2)
  Top 0.127: v86.48,8.8 88.61,10.93 88.61,26.18 IC4.40
  Bottom 0.127: v86.48,8.8 86.48,3.92 13B.1
A13'  (via drill 0.2)
  Top 0.127: v50.02,25.72 | v50.02,25.72 50.02,24.93 48.6,24.93 U1.58 | v57.23,25.68 59.35,27.8 v59.35,44.42 | v66.48,44.42 67.36,45.3 67.36,46.67 68.23,47.55 68.73,47.55 U2.28 | v82.11,44.42 82.11,42.3 IC4.99
  Bottom 0.127: v57.23,25.68 50.42,25.68 50.24,25.5 v50.02,25.72 | v59.35,44.42 v66.48,44.42 v82.11,44.42
A14  (via drill 0.2)
  Top 0.127: v85.36,9.05 85.98,9.68 85.98,22.18 87.23,23.43 87.23,26.18 IC4.37
  Bottom 0.127: v85.36,9.05 85.36,3.92 83.86,3.92 12B.1
A14'  (via drill 0.2)
  Top 0.127: v47.1,25.3 48.48,25.3 U1.59 | v51.62,24.58 51.98,24.94 v51.98,35.42 51.98,39.3 52.23,39.55 52.23,54.3 52.1,54.42 52.1,54.67 52.6,55.17 53.73,55.17 53.73,51.67 55.23,50.17 55.6,50.17 U2.3 | v81.11,34.92 81.11,35.3 79.73,35.3 IC4.11
  Bottom 0.127: v47.1,25.3 47.91,24.5 51.54,24.5 v51.62,24.58 | v81.11,34.92 80.86,34.67 67.48,34.67 67.23,34.92 63.23,34.92 62.73,34.42 56.48,34.42 55.48,35.42 v51.98,35.42
A15  (via drill 0.2)
  Top 0.127: v85.98,23.05 85.98,24.43 86.11,24.55 86.11,26.18 IC4.35 | v83.61,22.3 82.98,21.68 82.98,8.8 82.48,8.3 v82.48,8.18
  Bottom 0.127: v85.98,23.05 85.23,22.3 v83.61,22.3 | v82.48,8.18 82.48,3.92 81.36,3.92 11B.1
A15'  (via drill 0.2)
  Top 0.127: v43.65,27.7 43.65,25.93 | v61.48,27.93 62.23,28.68 62.23,29.3 61.85,29.68 61.85,39.67 61.98,39.8 v61.98,49.55 | 48.53,25.9 U1.60 | U2.31 68.73,51.42 68.23,51.42 v66.98,50.17 65.86,49.05 v65.86,36.55 | v81.11,37.3 81.11,37.8 79.73,37.8 IC4.6
  Top 0.152: 43.65,25.93 44.54,25.03 46.09,25.03 46.88,25.83 48.46,25.83 48.53,25.9
  Bottom 0.127: v43.65,27.7 43.88,27.93 v61.48,27.93 | v61.98,49.55 62.6,50.17 v66.98,50.17 | v81.11,37.3 80.11,36.3 72.73,36.3 72.48,36.55 v65.86,36.55
A16'  (via drill 0.2)
  Top 0.127: v30.36,30.43 30.36,27.93 32.48,27.93 U1.12 | v52.6,31.05 52.85,31.3 v52.85,42.3 | v51.6,43.55 50.98,44.17 50.98,54.05 52.48,55.55 54.35,55.55 v54.35,54.42 54.35,52.3 55.1,51.55 55.6,51.55 U2.2 | v78.36,41.92 77.61,41.17 77.61,38.42 78.23,37.8 78.23,37.3 79.61,37.3 IC4.7 | v80.98,43.42 81.48,43.92 81.48,47.67 82.23,48.42 v82.23,54.42
  Bottom 0.127: v30.36,30.43 30.46,30.53 51.96,30.53 52.48,31.05 v52.6,31.05 | v51.6,43.55 v52.85,42.3 | v78.36,41.92 79.86,43.42 v80.98,43.42 | v54.35,54.42 v82.23,54.42
A17'  (via drill 0.2)
  Top 0.127: v45.35,21.93 43.6,20.18 43.6,19.43 U1.44 | v63.35,22.18 63.35,25.3 63.85,25.8 63.85,35.17 64.11,35.42 64.11,36.92 | 64.11,36.92 64.11,40.3 63.6,40.8 63.6,54.17 65.11,55.67 70.11,55.67 70.11,51.05 69.23,50.17 68.86,50.17 U2.30 | v77.86,36.92 77.86,36.8 79.61,36.8 IC4.8 | 64.11,36.92 v63.85,36.92
  Bottom 0.127: v45.35,21.93 45.6,22.18 50.35,22.18 50.6,22.43 63.1,22.43 v63.35,22.18 | v77.86,36.92 73.61,36.92 73.36,37.17 70.86,37.17 70.61,36.92 66.23,36.92 65.98,37.17 64.11,37.17 v63.85,36.92
A18'  (via drill 0.2)
  Top 0.127: v43.3,28.43 43.1,28.23 43.1,19.43 U1.43 | v60.98,28.55 v60.98,40.05 60.98,51.42 58.23,54.17 55.73,54.17 55.73,52.8 U2.1 | v83.29,38.65 83.45,38.49 83.45,36.3 79.73,36.3 IC4.9
  Bottom 0.127: v43.3,28.43 43.3,28.55 v60.98,28.55 | v83.29,38.65 81.89,40.05 81.49,40.05 74.98,40.05 74.73,39.8 61.23,39.8 v60.98,40.05
ALE  (via drill 0.2)
  Top 0.127: v49.98,31.05 49.98,30.93 48.6,30.93 U1.70 | v29.36,33.3 29.23,33.42 29.23,39.92 IC8.11
  Bottom 0.127: v49.98,31.05 49.73,31.3 38.98,31.3 36.98,33.3 v29.36,33.3
AREF
  Top 0.127: C6.1 34.35,42.3 34.85,41.8 34.85,37.85 35.48,37.22 35.48,35.42 U1.98
B0  (via drill 0.2)
  Top 0.127: v32.25,39.42 33.1,38.57 33.1,34.42 35.85,34.42 35.98,34.55 35.98,35.3 U1.97 | v17.48,40.05 17.23,40.3 17.23,47.3 14.48,50.05 13.98,50.05 IC9.19
  Bottom 0.127: v32.25,39.42 31.62,40.05 v17.48,40.05
B1  (via drill 0.2)
  Top 0.127: v33.98,32.05 36.48,34.55 36.48,35.3 U1.96 | v21.11,31.55 20.86,31.8 20.86,39.92 20.11,40.67 17.61,40.67 17.61,48.17 14.98,50.8 12.61,50.8 12.61,49.8 13.48,48.92 13.86,48.92 IC9.18
  Bottom 0.127: v33.98,32.05 33.48,31.55 v21.11,31.55
B2  (via drill 0.2)
  Top 0.127: v36.98,33.92 36.98,35.3 U1.95 | v18.23,34.3 16.86,35.67 16.86,45.17 14.48,47.55 13.98,47.55 IC9.17
  Bottom 0.127: v36.98,33.92 36.6,34.3 v18.23,34.3
B3  (via drill 0.2)
  Top 0.127: v35.98,37.67 37.48,36.17 37.48,35.42 U1.94 | v32.47,37.67 32.47,37.7 31.73,38.45 v31.73,41.67 | v12.23,42.8 12.23,45.55 12.98,46.3 13.86,46.3 IC9.16
  Bottom 0.127: v32.47,37.67 v35.98,37.67 | v31.73,41.67 31.48,41.92 15.98,41.92 15.73,41.67 13.36,41.67 v12.23,42.8
B4  (via drill 0.2)
  Top 0.127: v38.73,41.67 38.73,40.17 38.1,39.55 38.1,35.42 U1.93 | v15.61,42.3 15.23,42.67 15.23,44.17 14.36,45.05 13.98,45.05 IC9.15
  Bottom 0.127: v38.73,41.67 38.1,42.3 v15.61,42.3
B5  (via drill 0.2)
  Top 0.127: v39.35,40.42 39.35,40.3 38.48,39.42 38.48,35.42 U1.92 | v16.23,40.67 16.23,44.55 15.11,45.67 12.86,45.67 12.61,45.42 12.61,44.67 13.36,43.92 13.86,43.92 IC9.14
  Bottom 0.127: v39.35,40.42 39.1,40.67 v16.23,40.67
B6  (via drill 0.2)
  Top 0.127: v36.98,32.55 38.98,34.55 38.98,35.3 U1.91 | v16.86,34.92 15.48,36.3 15.48,41.42 14.48,42.42 13.98,42.42 IC9.13
  Bottom 0.127: v36.98,32.55 36.73,32.8 29.61,32.8 29.48,32.67 19.11,32.67 v16.86,34.92
B7  (via drill 0.2)
  Top 0.127: v39.1,36.8 39.48,36.42 39.48,35.42 U1.90 | v14.11,37.05 12.61,38.55 12.61,40.42 13.36,41.17 13.86,41.17 IC9.12
  Bottom 0.127: v39.1,36.8 38.85,37.05 15.23,37.05 14.98,37.3 14.36,37.3 v14.11,37.05
CS_LLS
  Top 0.127: MICRO_SD1.2 12.86,11.05 15.48,11.05 15.48,7.8 17.98,5.3 25.11,5.3 25.11,5.8 IC6.8
CTRL_CLK  (via drill 0.2)
  Top 0.127: v49.98,29.18 49.98,27.93 48.6,27.93 U1.64 | v61.6,29.18 61.35,29.43 61.35,39.67 61.6,39.92 61.6,49.17 61.35,49.42 61.35,52.42 64.98,56.05 71.48,56.05 v71.48,49.67 | v81.61,49.55 81.23,49.17 81.23,47.92 80.36,47.05 79.98,47.05 IC3.9
  Bottom 0.127: v61.6,29.18 v49.98,29.18 | v71.48,49.67 71.61,49.55 v81.61,49.55
D0  (via drill 0.2)
  Top 0.127: v5.86,41.3 3.98,41.3 IC9.9 | v20.73,41.3 19.11,41.3 IC8.9 | IC5.12 46.48,41.17 45.98,41.17 45.23,40.42 45.23,38.67 45.48,38.42 v45.48,38.05 45.48,35.42 U1.78 45.6,35.3 v45.6,33.92 | v77.98,33.42 78.61,32.8 78.61,31.8 79.61,31.8 IC4.18 | v53.98,33.8 53.48,34.3 53.48,36.92 53.98,37.42 55.6,37.42 U2.13 | v61.23,7.8 61.23,6.17 63.48,3.92 4A.1 | v55.23,10.05 55.48,10.3 55.48,29.68 55.23,29.93 v55.23,32.8
  Bottom 0.127: v20.73,41.3 15.61,41.3 | 15.61,41.3 v5.86,41.3 | v77.98,33.42 71.98,33.42 71.86,33.3 55.23,33.3 | 55.23,33.3 54.48,33.3 54.1,33.67 | v45.6,33.92 45.85,33.67 54.1,33.67 | 54.1,33.67 v53.98,33.8 | 15.61,41.3 15.61,38.05 31.11,38.05 31.36,38.3 45.23,38.3 v45.48,38.05 | v61.23,7.8 58.98,10.05 v55.23,10.05 | 55.23,33.3 v55.23,32.8
D1  (via drill 0.2)
  Top 0.127: v7.11,42.55 3.98,42.55 IC9.8 | v20.73,43.05 19.11,43.05 IC8.8 | v81.11,31.3 79.73,31.3 IC4.19 | v46.1,36.8 46.1,35.42 U1.77 | v54.1,36.8 55.6,36.8 55.6,36.3 U2.14 55.73,36.17 56.23,36.17 57.98,34.42 57.98,31.8 v58.1,31.68 58.1,31.05 56.6,29.55 56.6,17.3 v59.98,13.93 | 44.73,42.42 46.48,42.42 IC5.13 | v44.73,37.55 44.73,42.42 | 44.73,42.42 v44.48,42.67 | v61.23,13.93 64.48,10.68 64.48,5.42 65.98,3.92 5A.1
  Bottom 0.127: v7.11,42.55 7.98,43.42 20.36,43.42 v20.73,43.05 21.11,42.67 v44.48,42.67 | v81.11,31.3 80.86,31.55 77.73,31.55 77.48,31.8 74.48,31.8 74.36,31.93 58.35,31.93 v58.1,31.68 | v54.1,36.8 v46.1,36.8 45.48,36.8 v44.73,37.55 | v59.98,13.93 v61.23,13.93
D2  (via drill 0.2)
  Top 0.127: v7.73,43.92 3.98,43.92 IC9.7 | v20.73,43.92 19.11,43.92 IC8.7 | v77.98,32.17 77.98,30.8 79.61,30.8 IC4.20 | U2.15 56.1,34.92 57.35,33.67 v57.35,32.05 57.35,30.8 56.23,29.68 56.23,13.8 v59.98,10.05 | v46.48,33.05 46.48,35.3 U1.76 46.6,35.42 46.85,35.67 46.85,38.55 47.85,39.55 47.85,42.92 46.98,43.8 46.6,43.8 IC5.14 46.48,43.8 46.48,43.42 v44.85,43.42 | v66.98,8.43 66.98,5.42 68.48,3.92 6A.1
  Bottom 0.127: v7.73,43.92 v20.73,43.92 21.36,43.3 44.73,43.3 v44.85,43.42 | v77.98,32.17 74.61,32.17 74.48,32.3 57.6,32.3 v57.35,32.05 55.23,32.05 54.35,32.92 46.6,32.92 v46.48,33.05 | v66.98,8.43 65.36,10.05 v59.98,10.05
D3  (via drill 0.2)
  Top 0.127: v82.36,12.05 82.36,22.55 | 82.36,22.55 82.36,24.55 83.11,25.3 83.11,26.18 IC4.29 | v79.73,11.8 76.23,8.3 76.23,3.92 9A.1 | 69.98,27.55 70.48,27.05 v70.48,23.3 | 69.98,27.55 69.23,28.3 69.23,33.17 68.86,33.55 U2.17 | 82.36,22.55 v82.61,22.55 | U1.75 48.6,33.42 48.85,33.67 v48.85,36.17 48.85,37.92 48.23,38.55 48.23,43.8 46.98,45.05 46.6,45.05 IC5.15 46.48,45.17 44.23,45.17 44.23,52.42 44.48,52.67 44.48,53.8 43.98,54.3 33.1,54.3 v33.1,47.3 | v9.73,45.17 3.98,45.17 IC9.6 | v20.73,45.17 19.11,45.17 IC8.6 | 69.98,27.55 69.48,27.05 v69.48,26.93 | v60.98,27.3 60.35,27.93 v60.35,35.05
  Bottom 0.127: v82.36,12.05 82.11,11.8 v79.73,11.8 | v70.48,23.3 71.23,22.55 74.73,22.55 74.98,22.3 78.73,22.3 78.98,22.55 v82.61,22.55 | v9.73,45.17 v20.73,45.17 30.98,45.17 v33.1,47.3 | v69.48,26.93 64.61,26.93 64.23,27.3 v60.98,27.3 | v60.35,35.05 59.23,36.17 v48.85,36.17
D4  (via drill 0.2)
  Top 0.127: v84.73,8.55 84.73,26.18 IC4.32 84.61,26.3 84.61,27.46 84.56,27.5 84.56,29.48 84.18,29.86 v84.18,30.01 | v79.86,8.3 78.86,7.3 78.86,3.92 10A.1 | U2.18 69.98,34.92 69.98,34.17 70.11,34.05 70.11,31.43 69.73,31.05 69.73,30.05 v69.86,29.93 | 47.98,35.67 47.98,37.3 v48.23,37.55 | 47.98,35.67 47.98,34.05 47.48,33.55 47.48,32.92 48.48,32.92 U1.74 | v49.1,38.42 48.85,38.67 48.85,44.55 47.1,46.3 46.6,46.3 IC5.16 | v10.86,46.3 3.98,46.3 IC9.5 | v20.73,46.3 19.11,46.3 IC8.5 | v47.85,35.67 47.98,35.67 | v65.98,29.93 65.86,30.05 v65.86,34.3
  Bottom 0.127: v84.73,8.55 84.23,9.05 80.61,9.05 v79.86,8.3 | v84.18,30.01 75.94,30.01 75.86,29.93 v69.86,29.93 v65.98,29.93 | v49.1,38.42 v48.23,37.55 | v20.73,46.3 v10.86,46.3 5.23,46.3 5.23,41.05 10.73,35.55 31.98,35.55 32.1,35.67 v47.85,35.67 47.98,35.55 49.85,35.55 50.6,34.8 55.6,34.8 56.35,34.05 65.61,34.05 v65.86,34.3
D5  (via drill 0.2)
  Top 0.127: v11.36,47.67 3.98,47.67 IC9.4 | v17.48,49.05 17.86,48.67 17.86,48.42 18.61,47.67 18.98,47.67 IC8.4 | v44.85,49.55 44.85,47.67 46.48,47.67 IC5.17 | v78.23,28.55 78.23,28.3 79.61,28.3 IC4.25 | 70.48,30.93 70.48,34.92 69.23,36.17 68.86,36.17 U2.19 | 70.48,30.93 v70.48,28.55 | 70.48,30.93 v70.36,30.93 | U1.73 48.48,32.3 v47.1,32.3 47.1,33.67 47.23,33.8 47.23,37.67 v47.48,37.92 | v72.98,28.55 72.98,25.3 73.23,25.05 73.23,4.3 73.61,3.92 8A.1 | v43.6,49.92 43.85,49.67 v43.85,40.42
  Bottom 0.127: v11.36,47.67 12.73,49.05 v17.48,49.05 18.11,49.67 43.6,49.67 | v44.85,49.55 44.73,49.67 43.6,49.67 | v70.48,28.55 v72.98,28.55 v78.23,28.55 | v47.1,32.3 47.73,31.68 53.48,31.68 54.48,30.68 62.1,30.68 62.6,31.18 70.11,31.18 v70.36,30.93 | v43.6,49.92 43.6,49.67 | v43.85,40.42 44.98,39.3 46.1,39.3 v47.48,37.92
D6  (via drill 0.2)
  Top 0.127: v77.73,29.3 79.61,29.3 IC4.23 | v71.11,29.18 71.11,3.92 7A.1 | v9.36,48.92 3.98,48.92 IC9.3 | v16.61,50.8 18.48,48.92 18.98,48.92 IC8.3 | 47.85,48.05 47.1,48.8 46.6,48.8 IC5.18 | 47.85,48.05 50.1,45.8 v50.1,37.55 50.1,35.42 49.73,35.05 49.73,31.93 48.6,31.93 U1.72 | v70.48,37.55 68.86,37.55 U2.20 | v48.23,51.3 47.85,50.92 47.85,48.05 | v76.11,37.55 v76.11,29.43
  Bottom 0.127: v77.73,29.3 77.61,29.18 76.11,29.18 | v71.11,29.18 76.11,29.18 | v9.36,48.92 11.23,50.8 v16.61,50.8 17.11,51.3 v48.23,51.3 | v50.1,37.55 v70.48,37.55 v76.11,37.55 | v76.11,29.43 76.11,29.18
D7  (via drill 0.2)
  Top 0.127: v11.36,50.17 3.98,50.17 IC9.2 | v17.48,50.67 18.98,50.67 18.98,50.17 IC8.2 19.11,50.05 21.11,50.05 21.11,46.67 21.73,46.05 21.73,31.05 v21.48,30.8 21.23,30.55 17.73,30.55 v17.73,21.55 | v44.85,50.42 44.85,50.17 46.48,50.17 IC5.19 | v45.12,29.11 45.12,30.7 45.72,31.3 48.48,31.3 U1.71 | v55.85,30.05 55.85,3.92 1A.1 55.73,3.55 v54.23,3.55 | v81.11,32.8 79.73,32.8 IC4.16 | v76.73,30.68 v76.73,32.8 | v80.36,42.8 80.36,45.3 79.98,45.67 IC3.8 | v89.48,40.92 89.73,40.67 89.73,34.3 89.48,34.05 v89.48,32.8 | v66.48,30.55 66.48,34.42 67.11,35.05 67.11,38.67 68.73,38.67 U2.21
  Bottom 0.127: v11.36,50.17 16.98,50.17 v17.48,50.67 44.6,50.67 v44.85,50.42 | v45.12,29.11 47.02,29.11 47.61,29.7 50.91,29.7 51.14,29.46 55.27,29.46 v55.85,30.05 61.98,30.05 62.48,30.55 v66.48,30.55 69.98,30.55 70.23,30.3 70.48,30.3 70.61,30.43 76.48,30.43 v76.73,30.68 | v76.73,32.8 v81.11,32.8 v89.48,32.8 | v80.36,42.8 82.23,40.92 v89.48,40.92 | v17.73,21.55 13.23,17.05 13.23,3.55 v54.23,3.55
DI_LLS  (via drill 0.2)
  Top 0.127: v15.23,12.18 12.86,12.18 MICRO_SD1.3 | v17.36,11.3 18.98,11.3 18.98,11.05 IC6.3
  Bottom 0.127: v15.23,12.18 16.11,11.3 v17.36,11.3
DO_LLC
  Top 0.127: R20.1 21.11,18.05 22.23,16.93 22.23,15.05 23.11,14.18 26.48,14.18 26.48,11.93 25.61,11.05 25.23,11.05 IC6.12
EN_M1_NOT  (via drill 0.2)
  Top 0.127: v41.6,17.93 41.6,19.3 U1.40 | v112.36,18.68 114.36,20.68 114.36,38.55 v113.23,39.67 | v97.98,43.67 96.61,42.3 93.73,42.3 IC4.76
  Bottom 0.127: v41.6,17.93 42.73,16.8 46.35,16.8 48.35,18.8 52.23,18.8 52.48,19.05 59.48,19.05 59.73,18.8 73.61,18.8 73.86,18.55 75.11,18.55 75.61,19.05 100.98,19.05 101.36,18.68 v112.36,18.68 | v113.23,39.67 109.23,43.67 v97.98,43.67
GET_CTRL_REG  (via drill 0.2)
  Top 0.127: v44.6,17.93 44.6,19.3 U1.46 | v59.98,20.3 59.73,20.55 59.73,44.05 60.35,44.67 v60.35,48.67 | v88.61,45.67 88.86,45.42 88.86,43.3 88.73,43.17 88.73,42.3 IC4.86
  Bottom 0.127: v44.6,17.93 46.23,19.55 50.98,19.55 51.85,20.43 59.85,20.43 v59.98,20.3 | v60.35,48.67 60.6,48.92 85.36,48.92 v88.61,45.67
GET_DATA_REG  (via drill 0.2)
  Top 0.127: v43.98,17.43 43.98,19.3 U1.45 | v101.36,29.3 v101.36,19.93 | v87.61,31.05 87.86,31.3 87.86,40.17 89.11,41.42 89.11,42.17 IC4.85
  Bottom 0.127: v43.98,17.43 44.1,17.3 46.23,17.3 48.1,19.18 51.1,19.18 51.98,20.05 59.48,20.05 59.98,19.55 73.86,19.55 74.11,19.3 74.86,19.3 75.48,19.93 v101.36,19.93 | v101.36,29.3 100.86,29.8 98.86,29.8 97.61,31.05 v87.61,31.05
GND  (via drill 0.2, 0.25, 0.35)
  Top 0.3: v33.98,28.18 33.98,28.43 32.6,28.43 U1.11 | 47.48,27.3 v47.1,27.3 | v91.73,36.42 91.73,35.17 | 91.73,35.17 v91.73,31.8 | v93.73,37.3 95.61,37.3 IC4.69 | IC4.21 79.73,30.3 81.86,30.3 v81.86,30.68 81.86,30.8 82.48,30.8 82.48,33.92 v85.23,36.67 | v94.23,35.17 94.23,33.8 95.61,33.8 IC4.62 | v91.86,35.17 91.73,35.17 | 94.48,40.3 94.23,40.3 v94.23,39.42 | 94.48,40.3 95.61,40.3 IC4.75 | v91.86,44.8 91.86,48.3 91.98,48.42 IC2.1 | 94.48,40.3 v94.48,41.67 | v83.61,39.8 81.61,39.8 81.61,42.17 IC4.100
  Top 0.305: 53.85,30.48 v53.84,30.47 | U1.62 48.49,26.85 48.26,26.85 48.17,26.94 47.66,26.94 47.48,27.12 47.48,27.3 47.48,29 v46.77,29.7 46,29.7 v45.72,29.98 | IC4.31 84.11,26.31 84.11,29.22 83.57,29.76 83.57,30.26 83.7,30.39 v83.7,30.71 | v91.86,44.8 90.12,44.8 89.63,44.31 IC4.84 | U1.99 35.03,37.15 34.49,37.7 34.49,38.03 v33.09,39.43 | v36.83,39.26 36.5,39.59 IC5.10 | C16.1 40.39,15.27 40.39,15.41 39.37,16.43 v39.37,16.51 | v37.02,16.51 37.02,16.85 37.69,17.51 37.69,18.07 37.53,18.22 U1.32 | IC4.44 90.63,27.54 90.62,27.55 90.62,28.05 90.96,28.39 90.96,31.03 v91.73,31.8 | v41.91,29.98 44.03,32.11 U1.81
  Top 0.4: 33.85,45.67 33.85,50.67 36.48,53.3 43.48,53.3 C1.2 | 33.85,45.67 33.85,45.3 | 33.85,45.3 33.85,44.42 34.23,44.05 C6.2 | v38.23,44.67 37.98,44.42 37.98,40.05 36.6,40.05 IC5.10 | v34.1,45.3 33.85,45.3 | 33.85,45.67 33.73,45.67 32.35,47.05 32.35,54.55 26.86,54.55 25.73,53.42 C3.2 25.61,53.3 12.48,53.3 C2.2 12.23,53.3 11.36,54.17 1.85,54.17 1.85,31.68 J1.S6 1.73,31.43 1.73,28.93 J1.S2 1.73,28.68 1.73,27.18 J1.S1 1.73,27.05 1.73,24.43 J1.S3 1.85,24.18 1.85,20.68 2.23,20.3 MICRO_SD1.MP2 2.35,20.18 11.61,20.18 MICRO_SD1.MP1 11.86,20.18 11.73,20.05 11.73,15.55 | 15.23,32.42 17.98,32.42 17.98,33.05 18.98,34.05 18.98,39.92 IC8.10 | 15.23,32.42 13.86,32.42 IC7.1 | v10.11,30.05 10.11,29.18 10.36,28.93 C8.1 | v21.48,29.8 21.86,30.18 22.61,30.18 R26.2 | v24.98,29.18 24.98,30.55 26.61,32.17 C13.2 | IC9.10 3.98,39.92 4.36,39.55 4.36,30.43 J1.S5 | v15.23,30.05 15.23,32.42 | 37.85,11.68 37.35,11.68 | 37.35,11.68 35.6,11.68 34.73,12.55 C5.1 | 37.85,11.68 37.85,12.68 C17.1 | v40.85,12.68 40.85,14.68 C16.1 | v37.98,11.55 37.85,11.68 | v42.73,11.43 44.48,9.68 44.48,5.17 IC1.3 | 20.36,9.05 19.73,9.68 19.11,9.68 IC6.4 | 20.36,9.05 20.48,8.93 20.48,5.92 19.11,5.92 IC6.7 | 20.48,13.43 19.11,13.43 IC6.1 | 20.48,13.43 20.48,9.18 20.36,9.05 | 23.98,11.68 24.48,12.18 25.11,12.18 IC6.13 | 23.98,11.68 23.73,11.43 23.73,8.55 25.11,8.55 IC6.10 25.36,8.43 25.86,8.43 26.61,7.67 26.61,4.8 | 26.61,4.8 26.61,3.42 29.98,3.42 30.61,4.05 30.61,4.67 31.11,5.17 LED2.2 | 20.48,13.43 20.86,13.8 20.86,14.18 21.36,14.68 21.98,14.68 21.98,14.55 22.73,13.8 22.73,12.93 23.98,11.68 | MICRO_SD1.MP4 11.86,5.17 2.35,5.17 2.35,4.55 MICRO_SD1.MP3
  Top 0.4: C21.1 7.36,23.18 7.36,25.18 C20.1 7.23,25.3 4.61,25.3 4.61,25.43 J1.S4 4.48,25.55 4.48,26.55 J1.5 | 11.73,15.55 12.73,15.55 MICRO_SD1.6 | MICRO_SD1.MP4 11.61,5.3 11.61,15.43 11.73,15.55 | 26.61,4.8 12.11,4.8 12.11,5.05 MICRO_SD1.MP4 | v37.35,7.8 37.35,11.68 | R9.1 110.61,44.05 112.98,44.05 R10.1 113.11,44.17 114.23,45.3 114.23,48.92 S1.1 | R8.1 107.86,44.05 105.23,46.67 105.23,51.05 104.23,52.05 JP6.6 | v96.23,48.55 92.11,48.55 IC2.1 | v69.48,55.05 69.48,54.67 68.23,54.67 C15.2 | C19.2 77.73,55.3 77.73,55.05 v76.61,55.05 76.23,54.67 v76.23,50.92 76.23,47.55 74.23,45.55 IC3.7 73.86,45.67 75.36,44.17 75.36,32.8 | C14.2 53.35,27.55 53.85,28.05 53.85,30.48 53.85,32.42 54.98,33.55 55.6,33.55 U2.16 55.85,33.55 v56.73,32.67 | 75.36,32.8 75.36,24.55 75.73,24.18 C18.2 75.86,24.05 75.86,14.8 v76.11,14.55 73.98,12.43 73.98,10.68 v73.86,10.55 | v98.98,26.05 98.73,25.8 v98.73,14.55 | v75.23,32.8 75.36,32.8
  Bottom 0.3: v33.98,28.18 34.6,27.55 42.85,27.55 43.35,27.05 46.85,27.05 v47.1,27.3 | v81.86,30.68 82.98,31.8 83.82,31.8 v91.73,31.8 | v91.73,36.42 92.61,37.3 v93.73,37.3 93.86,37.3 94.23,37.67 v94.23,39.42 | v94.23,35.17 94.11,35.3 91.98,35.3 v91.86,35.17 | v91.86,44.8 91.86,42.42 93.73,42.42 v94.48,41.67 | v83.61,39.8 85.23,38.17 v85.23,36.67
  Bottom 0.305: v53.84,30.47 52.88,30.47 52.58,30.16 47.23,30.16 v46.77,29.7 | v83.7,30.71 83.7,31.68 83.82,31.8 | v33.09,39.43 33.74,39.43 33.98,39.19 34.48,39.19 34.55,39.26 v36.83,39.26 | v39.37,16.51 v37.02,16.51 | v45.72,29.98 v41.91,29.98
  Bottom 0.4: v38.23,44.67 37.6,45.3 v34.1,45.3 | 15.23,29.93 10.23,29.93 v10.11,30.05 9.86,30.3 4.48,30.3 J1.S5 4.23,30.43 3.23,31.43 1.85,31.43 J1.S6 | 15.23,29.93 21.36,29.93 v21.48,29.8 21.98,29.3 24.86,29.3 v24.98,29.18 | v15.23,30.05 15.23,29.93 | v37.98,11.55 39.73,11.55 v40.85,12.68 42.1,11.43 v42.73,11.43 | J1.S4 4.36,25.43 3.35,24.43 1.85,24.43 J1.S3 | LED2.2 31.23,5.3 31.23,5.92 32.23,6.92 36.48,6.92 v37.35,7.8 53.6,7.8 54.6,8.8 58.6,8.8 63.48,3.92 4B.1 63.6,3.8 65.98,3.8 5B.1 66.11,3.92 66.11,7.67 67.23,7.67 70.11,10.55 v73.86,10.55 | 102.98,50.92 98.61,50.92 v96.23,48.55 93.86,50.92 v76.23,50.92 | 102.98,50.92 104.11,52.05 JP6.6 | 102.98,50.92 102.98,49.17 103.73,48.42 104.61,48.42 105.48,49.3 113.98,49.3 114.23,49.05 S1.1 | v76.61,55.05 v69.48,55.05 | v98.98,26.05 99.11,25.93 110.61,25.93 112.61,27.93 JP2.2 | v76.11,14.55 v98.73,14.55 | v56.73,32.67 56.85,32.8 v75.23,32.8
LE_IL  (via drill 0.2)
  Top 0.127: v30.48,38.67 30.48,31.43 32.48,31.43 U1.5 | v45.98,38.67 46.48,39.17 46.48,39.92 IC5.11
  Bottom 0.127: v45.98,38.67 v30.48,38.67
LE_OL  (via drill 0.2)
  Top 0.127: v93.23,40.42 93.23,38.8 95.61,38.8 IC4.72 | v64.61,45.05 63.98,44.42 63.98,40.92 64.48,40.42 64.48,30.68 64.23,30.43 64.23,23.68 v63.98,23.43 | v27.73,23.3 23.98,27.05 23.98,36.17 v24.23,36.42 | v14.86,36.67 14.73,36.8 14.73,39.17 13.98,39.92 IC9.11
  Bottom 0.127: v93.23,40.42 88.61,45.05 v64.61,45.05 | v63.98,23.43 47.35,23.43 46.48,22.55 34.6,22.55 33.85,23.3 v27.73,23.3 | v24.23,36.42 23.98,36.67 v14.86,36.67
LEDB  (via drill 0.2)
  Top 0.127: v27.48,26.93 27.48,24.8 28.36,23.93 28.36,11.55 27.98,11.18 R3.1 | v30.98,29.18 31.48,29.68 31.48,30.05 31.73,30.3 32.48,30.3 U1.7
  Bottom 0.127: v27.48,26.93 27.98,27.43 29.23,27.43 v30.98,29.18
LEDG  (via drill 0.2)
  Top 0.127: v28.48,36.17 28.48,27.93 28.73,27.68 28.73,12.68 30.23,11.18 R13.1 | v31.86,36.17 32.48,35.55 32.48,33.42 U1.1
  Bottom 0.127: v31.86,36.17 v28.48,36.17
LEDR
  Top 0.127: R2.1 32.73,11.18 33.23,11.68 33.23,19.8 34.48,21.05 34.48,22.18 34.6,22.3 34.6,29.55 33.35,30.8 32.6,30.8 U1.6
MISO  (via drill 0.2)
  Top 0.127: v26.36,19.3 26.36,18.93 25.73,18.3 R1.1 | 30.73,20.43 31.11,20.8 31.11,22.18 31.73,22.8 32.48,22.8 U1.22 | 30.73,20.43 v30.48,20.18 | v98.61,41.42 98.61,49.05 98.98,49.42 JP6.1 | v86.23,35.8 83.11,32.67 v83.11,27.68 | v79.98,24.8 79.48,24.3 79.48,22.3 79.73,22.05 79.73,14.68 v77.11,12.05 | v31.11,13.3 30.73,13.68 30.73,20.43
  Bottom 0.127: v26.36,19.3 27.23,20.18 v30.48,20.18 | v98.61,41.42 92.98,35.8 v86.23,35.8 | v83.11,27.68 80.23,24.8 v79.98,24.8 | v77.11,12.05 42.23,12.05 40.98,13.3 v31.11,13.3
MOSI  (via drill 0.2)
  Top 0.127: v33.98,22.43 33.6,22.8 33.6,23.05 33.35,23.3 32.6,23.3 U1.21 | R17.1 18.73,18.18 21.98,21.43 21.98,23.93 22.11,24.05 v25.36,24.05 25.36,21.8 v27.73,19.43 | v96.86,43.3 96.86,50.55 99.98,50.55 101.48,52.05 JP6.4 | v87.23,37.05 86.86,36.67 v86.86,28.43 | v78.48,23.55 77.48,22.55 v77.48,17.18 | v41.35,16.43 v49.1,16.43
  Bottom 0.127: v25.36,24.05 26.98,22.43 v33.98,22.43 | v96.86,43.3 90.61,37.05 v87.23,37.05 | v86.86,28.43 83.61,25.18 81.11,25.18 80.11,24.18 79.86,24.18 79.23,23.55 v78.48,23.55 | v77.48,17.18 76.73,16.43 v49.1,16.43 | v41.35,16.43 38.35,19.43 v27.73,19.43
N$1
  Top 0.127: R17.2 18.61,16.43 17.73,15.55 17.73,13.05 18.48,12.3 18.98,12.3 IC6.2
N$2  (via drill 0.2)
  Top 0.127: v96.86,40.92 96.86,39.8 95.73,39.8 IC4.74
  Bottom 0.127: v96.86,40.92 97.98,42.05 100.86,42.05 PAD8.1
N$3
  Top 0.127: R1.2 25.73,16.43 26.86,15.3 26.86,10.93 25.73,9.8 25.23,9.8 IC6.11
N$4
  Top 0.127: R22.2 11.98,31.55 13.73,31.55 13.73,31.18 IC7.2
N$9  (via drill 0.2)
  Top 0.127: v25.61,27.43 26.61,28.43 R18.2 | v17.11,20.05 17.11,11.8 16.73,11.43 16.73,10.3 18.48,8.55 18.98,8.55 IC6.5
  Bottom 0.127: v25.61,27.43 24.36,26.18 23.23,26.18 v17.11,20.05
N$11
  Top 0.127: IC4.65 95.73,35.3 100.86,35.3 100.86,36.67 PAD2.1
N$12  (via drill 0.2)
  Top 0.127: v9.23,29.18 9.23,30.05 8.98,30.3 R23.2 | v15.23,29.18 13.86,29.18 13.86,29.8 IC7.3
  Bottom 0.127: v15.23,29.18 v9.23,29.18
N$13  (via drill 0.2)
  Top 0.127: v19.86,16.55 20.98,16.55 R20.2 | v14.11,16.55 12.86,16.55 MICRO_SD1.7
  Bottom 0.127: v14.11,16.55 v19.86,16.55
N$14  (via drill 0.2)
  Top 0.127: v22.86,15.18 22.86,15.93 23.36,16.43 R21.2 | v21.61,13.93 22.23,13.3 22.23,9.43 24.36,7.3 25.11,7.3 IC6.9
  Bottom 0.127: v21.61,13.93 v22.86,15.18
N$15
  Top 0.127: R11.2 36.48,10.05 36.73,9.8 36.73,5.3 LED1.A
N$16  (via drill 0.2)
  Top 0.127: v99.73,35.92 99.73,35.8 95.73,35.8 IC4.66
  Bottom 0.127: v99.73,35.92 99.98,35.67 101.86,35.67 102.86,36.67 PAD3.1
N$19  (via drill 0.2)
  Top 0.127: v93.61,34.67 93.61,36.3 95.61,36.3 IC4.67
  Bottom 0.127: v93.61,34.67 93.73,34.55 102.23,34.55 103.98,36.3 103.98,38.55 102.98,38.55 PAD4.1
N$22
  Top 0.127: IC4.68 95.73,36.8 99.86,36.8 99.86,37.55 100.86,38.55 PAD5.1
N$23
  Top 0.127: IC4.73 95.73,39.3 99.36,39.3 99.36,42.05 100.61,43.3 102.23,43.3 102.23,41.05 102.86,40.42 PAD6.1
N$24  (via drill 0.2)
  Top 0.127: v82.23,27.68 82.23,26.3 IC4.27
  Bottom 0.127: v82.23,27.68 81.11,26.55 79.48,26.55 PAD1.1
N$25
  Top 0.127: IC4.70 95.73,37.8 99.61,37.8 99.61,39.05 100.86,40.3 PAD7.1
N$26
  Top 0.127: R2.2 32.6,9.43 32.6,5.3 LED2.1
N$27
  Top 0.127: R3.2 27.98,9.43 27.98,5.3 LED2.4
N$28
  Top 0.127: R13.2 30.23,9.3 29.61,8.68 29.61,5.3 LED2.3
N$30
  Top 0.127: C8.2 12.23,28.8 13.73,28.8 13.73,28.68 IC7.4
N$31  (via drill 0.2)
  Top 0.127: R27.2 10.36,24.8 10.36,25.18 9.11,25.18 C20.2 9.11,25.3 9.36,25.55 v9.36,26.43 | Q2.3 11.36,35.42 12.23,34.55 12.23,33.05 11.61,32.42 11.11,32.42 11.11,29.68 11.36,29.43 11.36,26.18 11.98,25.55 12.86,25.55 13.73,24.68 IC7.7 13.86,24.68 v15.23,26.05
  Bottom 0.127: v9.36,26.43 9.73,26.05 v15.23,26.05
N$32  (via drill 0.2)
  Top 0.127: 12.11,23.55 12.11,24.68 R27.1 | 12.11,23.55 12.11,23.18 9.23,23.18 C21.2 | v9.11,31.8 9.11,33.55 Q2.1 | v15.98,30.68 15.86,30.55 15.86,25.3 14.11,23.55 13.86,23.55 IC7.8 13.73,23.55 12.11,23.55
  Bottom 0.127: v9.11,31.8 10.23,30.68 v15.98,30.68
N$33  (via drill 0.2)
  Top 0.127: v87.98,13.3 88.23,13.55 88.23,26.18 IC4.39
  Bottom 0.127: v87.98,13.3 88.61,12.68 105.36,12.68 JP1.2
N$36
  Top 0.127: U1.33 38.11,19.32 38.11,14.89 R19.2 37.98,14.68 38.73,13.93 38.73,6.17 38.23,5.67 38.23,4.8 40.98,2.05 47.85,2.05 47.85,9.3 47.23,9.93 47.23,11.43 48.1,12.3 Q1.3 48.1,12.43 48.1,14.68 42.73,14.68 C16.2
N$37